# Altium schematic sheet Main DC-DC.SchDoc
size A4; SheetNumber: 1; SheetTotal: 1
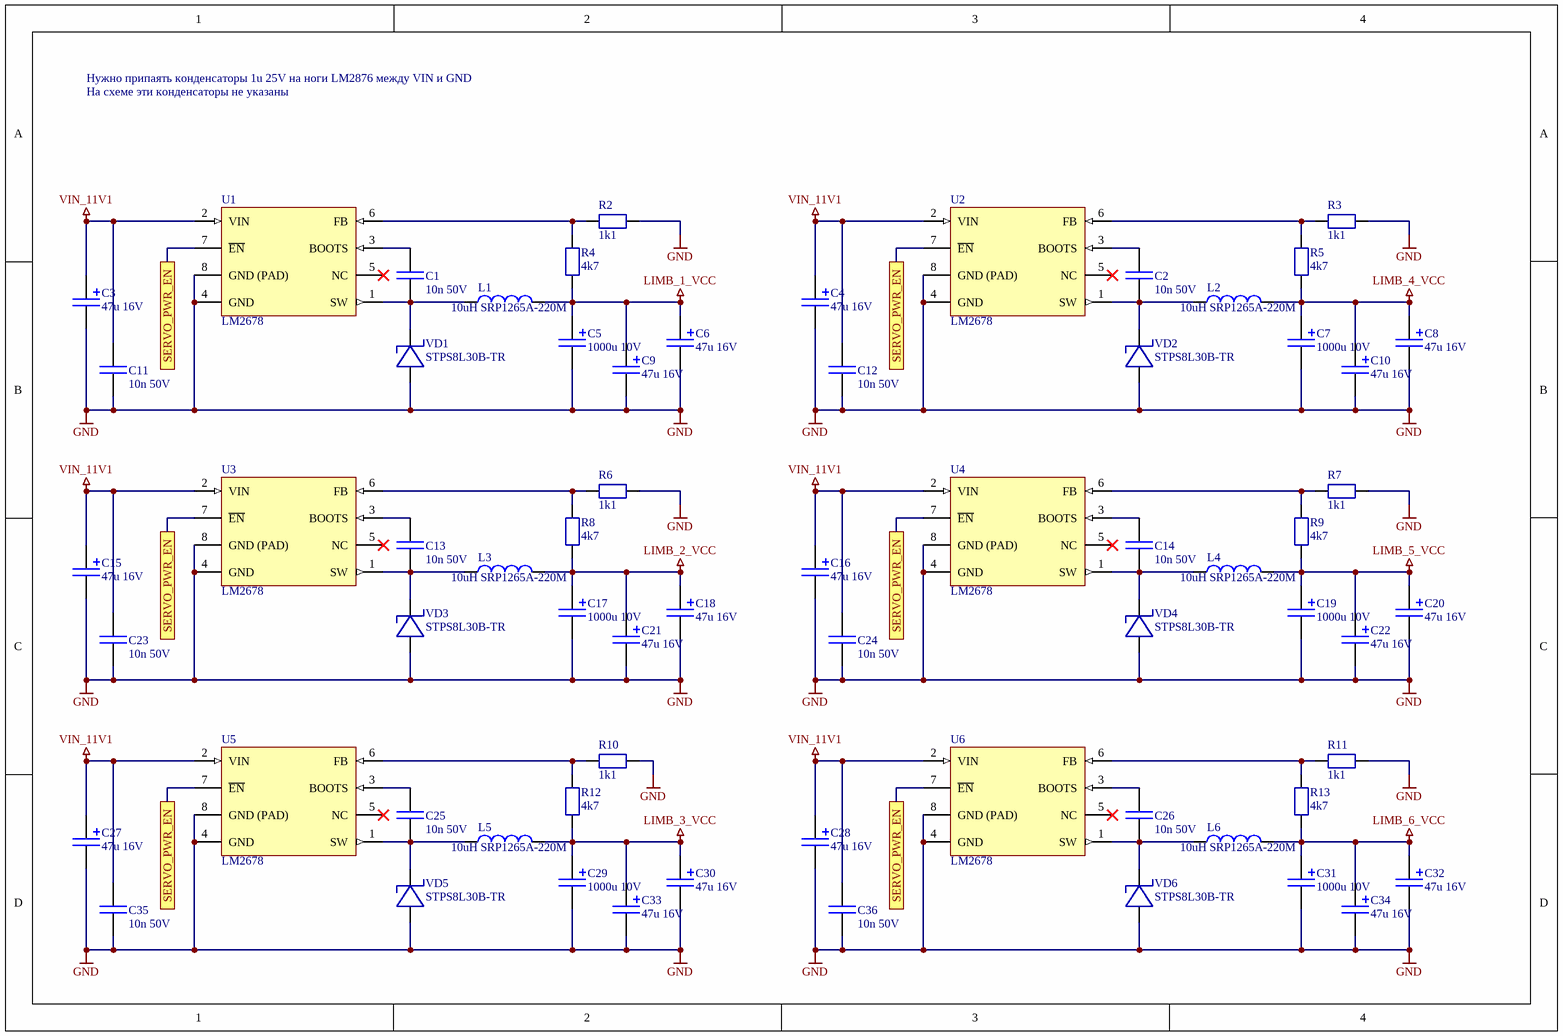
[diagram p0: Main DC-DC.SchDoc]

## Parts
C1  10n 50V  [C_0805/2012]
C2  10n 50V  [C_0805/2012]
C3  47u 16V  [TECAP_TYPE_C]
C4  47u 16V  [TECAP_TYPE_C]
C5  1000u 10V  [ECAP_D10.0x10.5]
C6  47u 16V  [TECAP_TYPE_D]
C7  1000u 10V  [ECAP_D10.0x10.5]
C8  47u 16V  [TECAP_TYPE_D]
C9  47u 16V  [TECAP_TYPE_D]
C10  47u 16V  [TECAP_TYPE_D]
C11  10n 50V  [C_0805/2012]
C12  10n 50V  [C_0805/2012]
C13  10n 50V  [C_0805/2012]
C14  10n 50V  [C_0805/2012]
C15  47u 16V  [TECAP_TYPE_C]
C16  47u 16V  [TECAP_TYPE_C]
C17  1000u 10V  [ECAP_D10.0x10.5]
C18  47u 16V  [TECAP_TYPE_D]
C19  1000u 10V  [ECAP_D10.0x10.5]
C20  47u 16V  [TECAP_TYPE_D]
C21  47u 16V  [TECAP_TYPE_D]
C22  47u 16V  [TECAP_TYPE_D]
C23  10n 50V  [C_0805/2012]
C24  10n 50V  [C_0805/2012]
C25  10n 50V  [C_0805/2012]
C26  10n 50V  [C_0805/2012]
C27  47u 16V  [TECAP_TYPE_C]
C28  47u 16V  [TECAP_TYPE_C]
C29  1000u 10V  [ECAP_D10.0x10.5]
C30  47u 16V  [TECAP_TYPE_D]
C31  1000u 10V  [ECAP_D10.0x10.5]
C32  47u 16V  [TECAP_TYPE_D]
C33  47u 16V  [TECAP_TYPE_D]
C34  47u 16V  [TECAP_TYPE_D]
C35  10n 50V  [C_0805/2012]
C36  10n 50V  [C_0805/2012]
L1  10uH SRP1265A-220M  [L_13x13]
L2  10uH SRP1265A-220M  [L_13x13]
L3  10uH SRP1265A-220M  [L_13x13]
L4  10uH SRP1265A-220M  [L_13x13]
L5  10uH SRP1265A-220M  [L_13x13]
L6  10uH SRP1265A-220M  [L_13x13]
R2  1k1  [R_0805/2012]
R3  1k1  [R_0805/2012]
R4  4k7  [R_0805/2012]
R5  4k7  [R_0805/2012]
R6  1k1  [R_0805/2012]
R7  1k1  [R_0805/2012]
R8  4k7  [R_0805/2012]
R9  4k7  [R_0805/2012]
R10  1k1  [R_0805/2012]
R11  1k1  [R_0805/2012]
R12  4k7  [R_0805/2012]
R13  4k7  [R_0805/2012]
U1  LM2678  [TO263-7/D2PAK-7]
U2  LM2678  [TO263-7/D2PAK-7]
U3  LM2678  [TO263-7/D2PAK-7]
U4  LM2678  [TO263-7/D2PAK-7]
U5  LM2678  [TO263-7/D2PAK-7]
U6  LM2678  [TO263-7/D2PAK-7]
VD1  STPS8L30B-TR  [TO252AA/DPAK]
VD2  STPS8L30B-TR  [TO252AA/DPAK]
VD3  STPS8L30B-TR  [TO252AA/DPAK]
VD4  STPS8L30B-TR  [TO252AA/DPAK]
VD5  STPS8L30B-TR  [TO252AA/DPAK]
VD6  STPS8L30B-TR  [TO252AA/DPAK]

## Ports
SERVO_PWR_EN

## Nets
GND: C3.2(NEG) C4.2(NEG) C5.2(NEG) C6.2(NEG) C7.2(NEG) C8.2(NEG) C9.2(NEG) C10.2(NEG) C11.2 C12.2 C15.2(NEG) C16.2(NEG) C17.2(NEG) C18.2(NEG) C19.2(NEG) C20.2(NEG) C21.2(NEG) C22.2(NEG) C23.2 C24.2 C27.2(NEG) C28.2(NEG) C29.2(NEG) C30.2(NEG) C31.2(NEG) C32.2(NEG) C33.2(NEG) C34.2(NEG) C35.2 C36.2 R2.2 R3.2 R6.2 R7.2 R10.2 R11.2 U1.4(GND) U1.8(GND_(PAD)) U2.4(GND) U2.8(GND_(PAD)) U3.4(GND) U3.8(GND_(PAD)) U4.4(GND) U4.8(GND_(PAD)) U5.4(GND) U5.8(GND_(PAD)) U6.4(GND) U6.8(GND_(PAD)) VD1.1 VD2.1 VD3.1 VD4.1 VD5.1 VD6.1
LIMB_1_VCC: C5.1(POS) C6.1(POS) C9.1(POS) L1.2 R4.2
LIMB_2_VCC: C17.1(POS) C18.1(POS) C21.1(POS) L3.2 R8.2
LIMB_3_VCC: C29.1(POS) C30.1(POS) C33.1(POS) L5.2 R12.2
LIMB_4_VCC: C7.1(POS) C8.1(POS) C10.1(POS) L2.2 R5.2
LIMB_5_VCC: C19.1(POS) C20.1(POS) C22.1(POS) L4.2 R9.2
LIMB_6_VCC: C31.1(POS) C32.1(POS) C34.1(POS) L6.2 R13.2
VIN_11V1: C3.1(POS) C4.1(POS) C11.1 C12.1 C15.1(POS) C16.1(POS) C23.1 C24.1 C27.1(POS) C28.1(POS) C35.1 C36.1 U1.2(VIN) U2.2(VIN) U3.2(VIN) U4.2(VIN) U5.2(VIN) U6.2(VIN)
SERVO_PWR_EN: U1.7(~{EN}) U2.7(~{EN}) U3.7(~{EN}) U4.7(~{EN}) U5.7(~{EN}) U6.7(~{EN}) ; port SERVO_PWR_EN
NetC1_1: C1.1 U1.3(BOOTS)
NetC1_2: C1.2 L1.1 U1.1(SW) VD1.2
NetC2_1: C2.1 U2.3(BOOTS)
NetC2_2: C2.2 L2.1 U2.1(SW) VD2.2
NetC13_1: C13.1 U3.3(BOOTS)
NetC13_2: C13.2 L3.1 U3.1(SW) VD3.2
NetC14_1: C14.1 U4.3(BOOTS)
NetC14_2: C14.2 L4.1 U4.1(SW) VD4.2
NetC25_1: C25.1 U5.3(BOOTS)
NetC25_2: C25.2 L5.1 U5.1(SW) VD5.2
NetC26_1: C26.1 U6.3(BOOTS)
NetC26_2: C26.2 L6.1 U6.1(SW) VD6.2
NetR2_1: R2.1 R4.1 U1.6(FB)
NetR3_1: R3.1 R5.1 U2.6(FB)
NetR6_1: R6.1 R8.1 U3.6(FB)
NetR7_1: R7.1 R9.1 U4.6(FB)
NetR10_1: R10.1 R12.1 U5.6(FB)
NetR11_1: R11.1 R13.1 U6.6(FB)

Not connected (* = marked no-connect by the designer): U1 5(NC)*; U2 5(NC)*; U3 5(NC)*; U4 5(NC)*; U5 5(NC)*; U6 5(NC)*

## Notes on the sheet
- Нужно припаять конденсаторы 1u 25V на ноги LM2876 между VIN и GND
- На схеме эти конденсаторы не указаны

## Library data of the parts
C1 C2 C11-C14 C23-C26 C35 C36 = Capacitor: Non-polarized capacitor
C3-C10 C15-C22 C27-C34 = Capacitor polar: Polarized capacitor
L1-L6 = Inductor
R2-R13 = Resistor
U1-U6 = LM2678: DC-DC step-down switching regulator
VD1-VD6 = Schottky: Schottky diode; pin to pad: 2>3